# Altium project EPM240_Board.PrjPcb
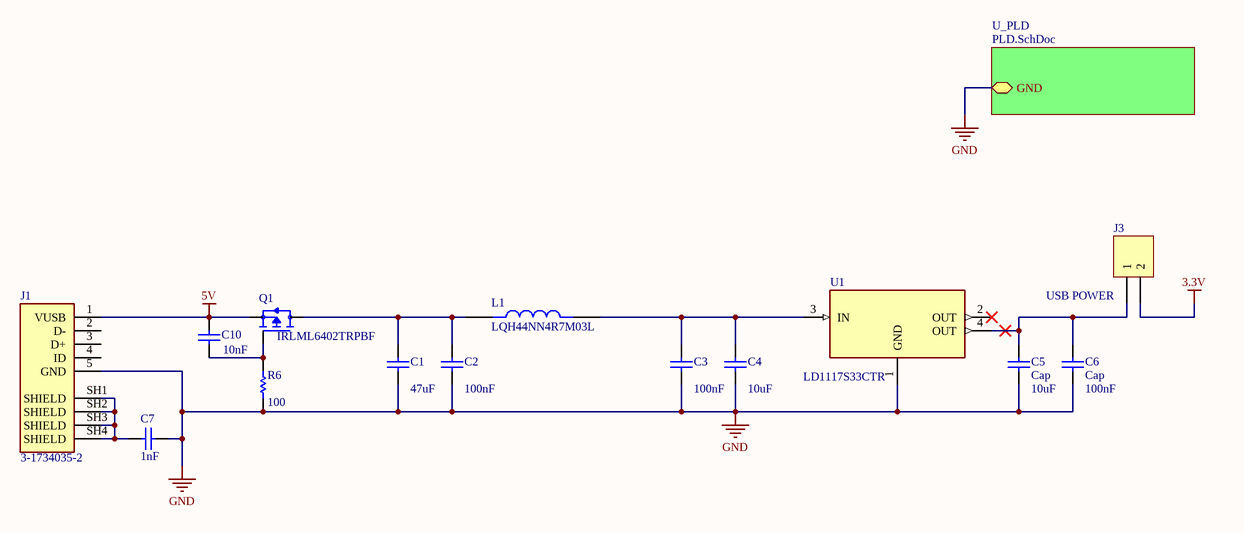
[diagram p0: PWR.SchDoc]
2 sheets, 69 parts. Net scope: hierarchical (ports join the sheet entries above them; power ports are global).
Board file: EPM240_Board.PcbDoc
Sheets:
  PWR.SchDoc
    U_PLD = PLD.SchDoc

## Sheet PWR.SchDoc
size A; SheetNumber: 1; SheetTotal: 2

### Parts
C1  value 47uF  [WCAP-CSGP_885012209019]  (hidden comment: Cap)
C2  value 100nF  [WCAP-CSST_885382207009]  (hidden comment: Cap)
C3  value 100nF  [WCAP-CSST_885382207009]  (hidden comment: Cap)
C4  value 10uF  [WCAP-CSST_885382207009]  (hidden comment: Cap)
C5  Cap  value 10uF  [WCAP-CSST_885382207009]
C6  Cap  value 100nF  [WCAP-CSST_885382207009]
C7  value 1nF  [WCAP-CSST_885382207009]  (hidden comment: Cap)
C10  value 10nF  [WCAP-CSST_885382207009]  (hidden comment: Cap)
J1  3-1734035-2  [TE_3-1734035-2]
J3  USB POWER  [HDR1X2]
L1  LQH44NN4R7M03L  [IND_LQH44NN4R7M03L]
Q1  IRLML6402TRPBF  [SOT95P237X112-3N]
R6  value 100  [WCAP-CSST_885382207009]  (hidden comment: Res1)
U1  LD1117S33CTR  [SOT223]

### Sub-sheets
U_PLD = PLD.SchDoc: GND (bidir)

### Nets
3.3V: J3.2
5V: C10.2 J1.1(VUSB) Q1.2(S)
GND: C1.1 C2.1 C3.1 C4.1 C5.1 C6.1 C7.2 J1.5(GND) R6.1 U1.1(GND) ; sheet U_PLD/GND
NetC1_2: C1.2 C2.2 L1.1 Q1.3(D)
NetC3_2: C3.2 C4.2 L1.2 U1.3(IN)
NetC5_2: C5.2 C6.2 J3.1 U1.4(OUT)
NetC7_1: C7.1 J1.SH1(SHIELD) J1.SH2(SHIELD) J1.SH3(SHIELD) J1.SH4(SHIELD)
NetC10_1: C10.1 Q1.1(G) R6.2

Not connected (* = marked no-connect by the designer): J1 2(D-) 3(D+) 4(ID); U1 2(OUT)*

### Library data of the parts
C1-C7 C10 = Cap: Capacitor; Published: 8-Jun-2000; LatestRevisionDate: 17-Jul-2002; LatestRevisionNote: Re-released for DXP Platform.; PackageReference: RAD-0.3; Publisher: Altium Limited; PackageDescription: Radial Cap, Thru-Hole; 2 Leads; 0.3 in Pin Spacing
J1 = 3-1734035-2: USB Connectors MINI USB, R/A, SMT, MATTE TIN, W/O MYLAR; MF: TE Connectivity; Value: *; SnapEDA_Link: https://www.snapeda.com/parts/3-1734035-2/TE+Connectivity+AMP+Connectors/view-part/?ref=snap; Purchase-URL: https://pricing.snapeda.com/search/part/3-1734035-2/?ref=eda; Availability: In Stock; Price: None; Package: None; Check_prices: https://www.snapeda.com/parts/3-1734035-2/TE+Connectivity+AMP+Connectors/view-part/?ref=eda; MP: 3-1734035-2
J3 = Header 2: Header, 2-Pin; LatestRevisionDate: 17-Jul-2002; LatestRevisionNote: Re-released for DXP Platform.; Publisher: Altium Limited
L1 = LQH44NN4R7M03L: FIXED IND 22UH 950MA 170 MOHM; Package: None; Price: None; Value: *; MP: LQH44NN4R7M03L; Availability: Unavailable
Q1 = IRLML6402TRPBF: RoHS Compliant | Industry-leading quality | Fast Switching | Low Profile _less than 1.1mm_ | P-Channel MOSFET | SOT-23 Footprint; MF: Infineon; Package: SOT-23 Infineon; Value: *; Price: None; MP: IRLML6402TRPBF; SnapEDA_Link: https://www.snapeda.com/parts/IRLML6402TRPBF/Infineon%20Technologies/view-part/523558/?ref=snap; Availability: Unavailable
R6 = Res1: Resistor; Published: 8-Jun-2000; LatestRevisionDate: 17-Jul-2002; LatestRevisionNote: Re-released for DXP Platform.; PackageReference: AXIAL-0.3; Publisher: Altium Limited; PackageDescription: Axial Device, Thru-Hole; 2 Leads; 0.3 in Pin Spacing
U1 = LD1117S33CTR: Linear Voltage Regulator IC Positive Fixed 1 Output 800mA SOT-223; MF: STMicroelectronics; Package: SOT-223 STMicroelectronics; Purchase-URL: https://pricing.snapeda.com/search/part/LD1117S33CTR/?ref=eda; MP: LD1117S33CTR; Value: *; Availability: In Stock; SnapEDA_Link: https://www.snapeda.com/parts/LD1117S33CTR/STMicroelectronics/view-part/?ref=snap; Price: None; Check_prices: https://www.snapeda.com/parts/LD1117S33CTR/STMicroelectronics/view-part/?ref=eda

## Sheet PLD.SchDoc
size 381 x 241 mm; SheetNumber: 2; SheetTotal: 2; SPICEModelCacheQEXEVNCX: <root> / <DocumentId>QEXEVNCX</DocumentId> / <CacheFrame Number="0"> / <Model Name="led0" Kind="MDL"> / <Text>*Typ INFRARED GaAs LED: Vf=1.2V Vr=5V If=40mA trr=3uS / *LED Pinout: 1=A, 2=K / .MODEL LED0 D (IS=93.5P RS=84M N=2.63 BV=5 IBV=10U / + CJO=2.97P VJ=.75 M=.333 TT=4.32U)</Text> / </Model> / </CacheFrame> / </root>
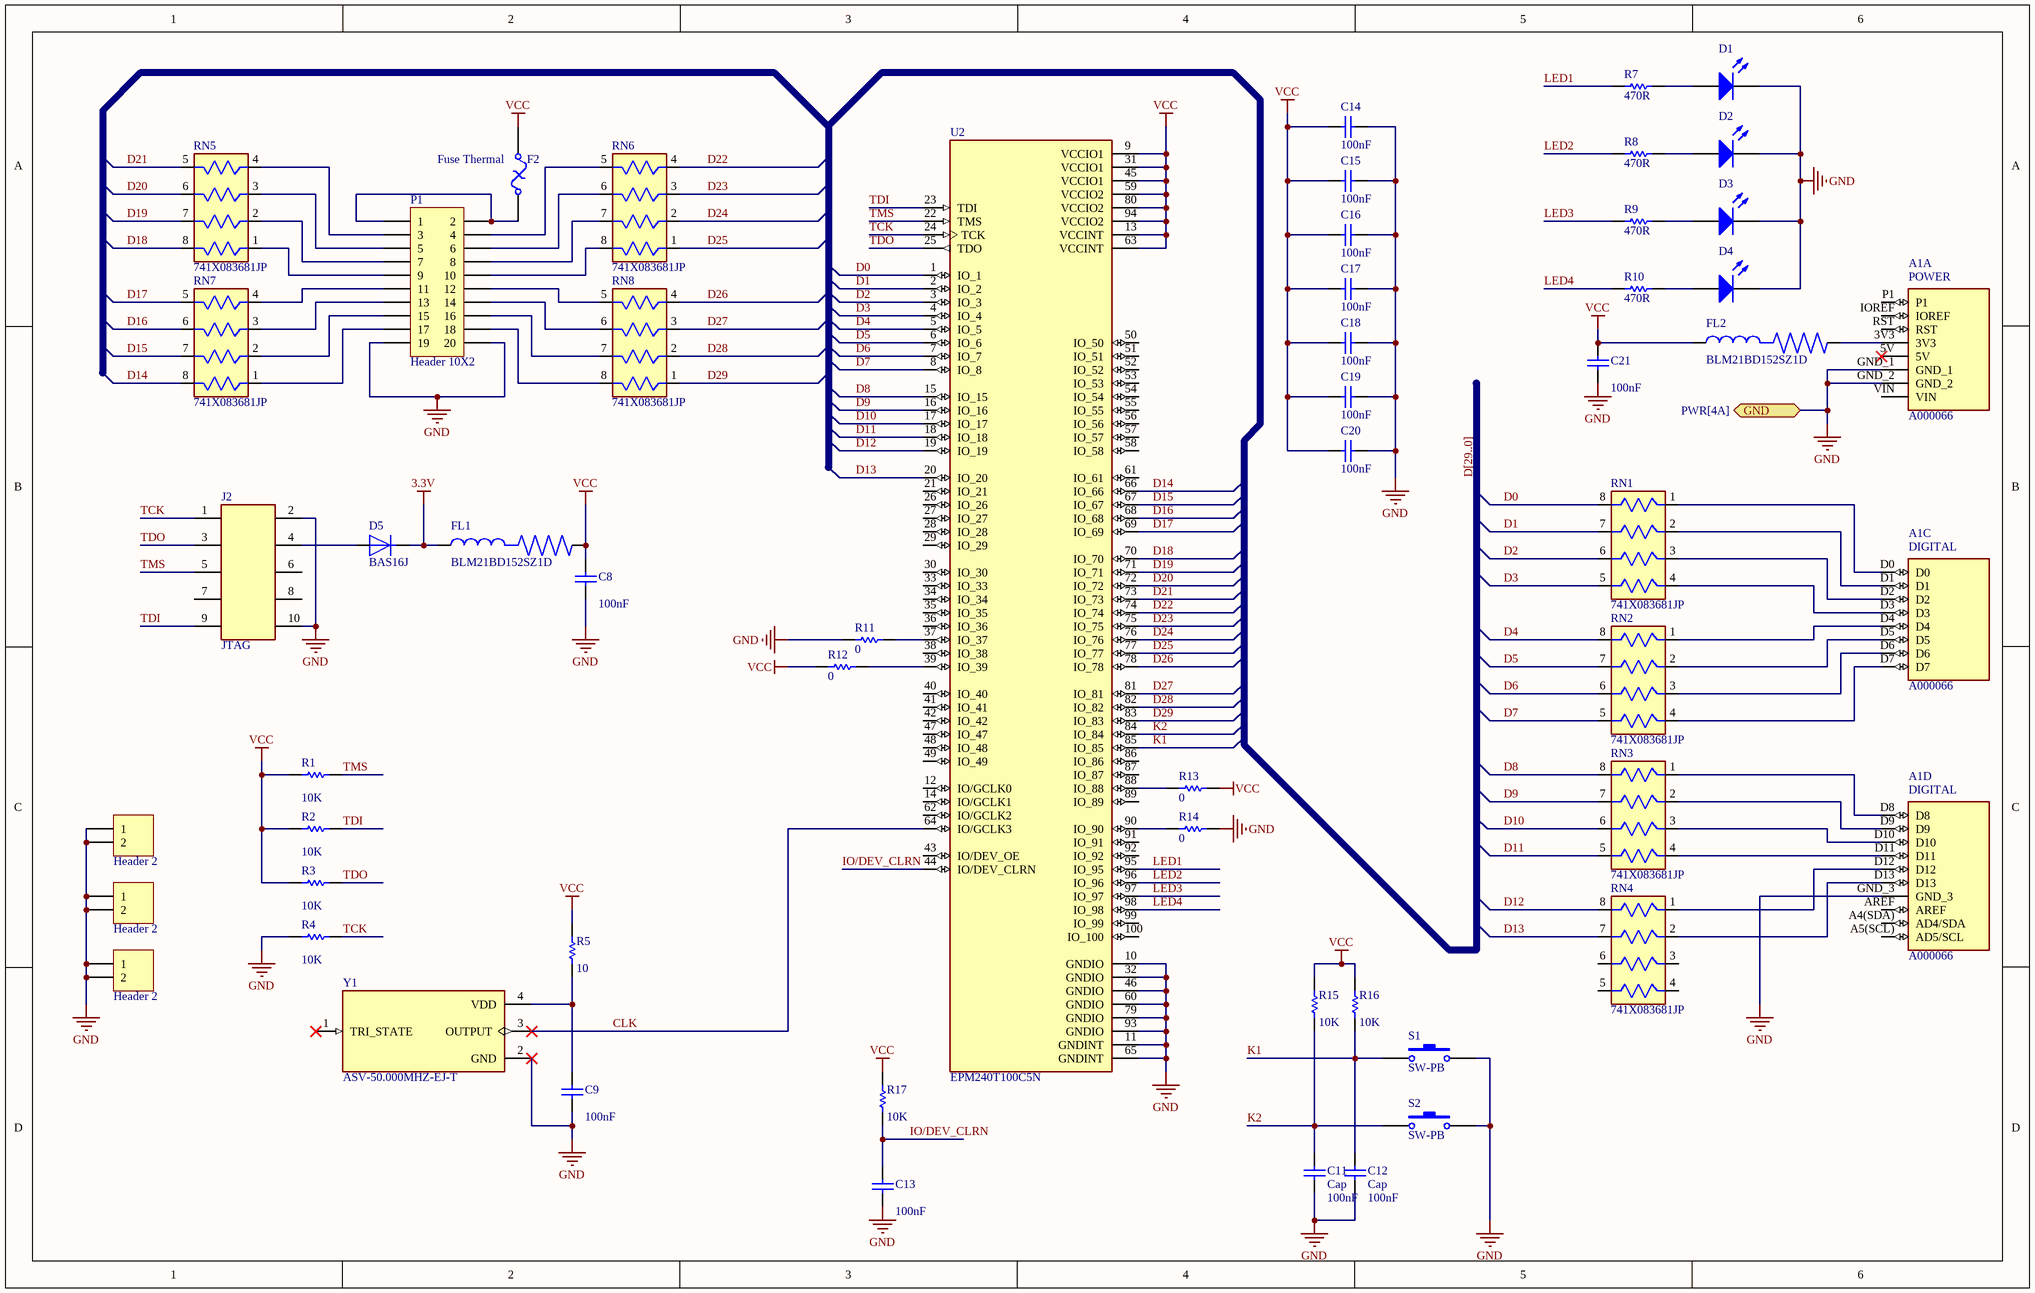
[diagram p1: PLD.SchDoc]

### Parts
A1  A000066  [ARDUINO_A000066]  (parts A,C,D of 4)
C8  value 100nF  [CAPC1608X90]  (hidden comment: Cap)
C9  value 100nF  [CAPC1608X90]  (hidden comment: Cap)
C11  Cap  value 100nF  [WCAP-CSGP_885012105016]
C12  Cap  value 100nF  [WCAP-CSGP_885012105016]
C13  value 100nF  [WCAP-CSGP_885012105016]  (hidden comment: Cap)
C14  value 100nF  [WCAP-CSGP_885012105016]  (hidden comment: Cap)
C15  value 100nF  [WCAP-CSGP_885012105016]  (hidden comment: Cap)
C16  value 100nF  [WCAP-CSGP_885012105016]  (hidden comment: Cap)
C17  value 100nF  [WCAP-CSGP_885012105016]  (hidden comment: Cap)
C18  value 100nF  [WCAP-CSGP_885012105016]  (hidden comment: Cap)
C19  value 100nF  [WCAP-CSGP_885012105016]  (hidden comment: Cap)
C20  value 100nF  [WCAP-CSGP_885012105016]  (hidden comment: Cap)
C21  value 100nF  [CAPC1608X90]  (hidden comment: Cap)
D1  LED0  [CAPC1608X90]  (value not drawn)
D2  LED0  [CAPC1608X90]  (value not drawn)
D3  LED0  [CAPC1608X90]  (value not drawn)
D4  LED0  [CAPC1608X90]  (value not drawn)
D5  BAS16J  [SOD323F]
F2  Fuse Thermal  [C1206]
FL1  BLM21BD152SZ1D  [C1206]
FL2  BLM21BD152SZ1D  [C1206]
H2  Header 2  [HDR1X2]
H3  Header 2  [HDR1X2]
H4  Header 2  [HDR1X2]
J2  JTAG  [61201021621]
P1  Header 10X2  [2002132110020C4LF]
R1  value 10K  [CAPC1608X90]  (hidden comment: Res1)
R2  value 10K  [CAPC1608X90]  (hidden comment: Res1)
R3  value 10K  [CAPC1608X90]  (hidden comment: Res1)
R4  value 10K  [CAPC1608X90]  (hidden comment: Res1)
R5  value 10  [CAPC1608X90]  (hidden comment: Res1)
R7  value 470R  [CAPC1608X90]  (hidden comment: Res1)
R8  value 470R  [CAPC1608X90]  (hidden comment: Res1)
R9  value 470R  [CAPC1608X90]  (hidden comment: Res1)
R10  value 470R  [CAPC1608X90]  (hidden comment: Res1)
R11  value 0  [WCAP-CSGP_885012105016]  (hidden comment: Res1)
R12  value 0  [WCAP-CSGP_885012105016]  (hidden comment: Res1)
R13  value 0  [WCAP-CSGP_885012105016]  (hidden comment: Res1)
R14  value 0  [WCAP-CSGP_885012105016]  (hidden comment: Res1)
R15  value 10K  [WCAP-CSGP_885012105016]  (hidden comment: Res1)
R16  value 10K  [WCAP-CSGP_885012105016]  (hidden comment: Res1)
R17  value 10K  [WCAP-CSGP_885012105016]  (hidden comment: Res1)
RN1  741X083681JP  [RESCAXS50P200X100X45_8N]
RN2  741X083681JP  [RESCAXS50P200X100X45_8N]
RN3  741X083681JP  [RESCAXS50P200X100X45_8N]
RN4  741X083681JP  [RESCAXS50P200X100X45_8N]
RN5  741X083681JP  [RESCAXS50P200X100X45_8N]
RN6  741X083681JP  [RESCAXS50P200X100X45_8N]
RN7  741X083681JP  [RESCAXS50P200X100X45_8N]
RN8  741X083681JP  [RESCAXS50P200X100X45_8N]
S1  SW-PB  [SW_4.5X4.5]
S2  SW-PB  [SW_4.5X4.5]
U2  EPM240T100C5N  [QFP50P1600X1600X120-100N]
Y1  ASV-50.000MHZ-EJ-T  [XTAL_ASV-50.000MHZ-EJ-T]

### Ports
GND (bidir, see PWR[4A])

### Nets
3.3V: D5.1(K) FL1.1
GND: A1.GND_1 A1.GND_2 A1.GND_3 C8.1 C9.1 C11.1 C12.1 C13.1 C14.1 C15.1 C16.1 C17.1 C18.1 C19.1 C20.1 C21.1 D1.2(K) D2.2(K) D3.2(K) D4.2(K) H2.1 H2.2 H3.1 H3.2 H4.1 H4.2 J2.2 J2.10 P1.19 P1.20 R4.1 R11.2 R14.1 S1.2 S2.2 U2.10(GNDIO) U2.11(GNDINT) U2.32(GNDIO) U2.46(GNDIO) U2.60(GNDIO) U2.65(GNDINT) U2.79(GNDIO) U2.93(GNDIO) Y1.2(GND) ; port GND
VCC: C8.2 C14.2 C15.2 C16.2 C17.2 C18.2 C19.2 C20.2 C21.2 F2.2 FL1.2 FL2.1 R1.1 R2.1 R3.1 R5.2 R12.2 R13.1 R15.2 R16.2 R17.2 U2.9(VCCIO1) U2.13(VCCINT) U2.31(VCCIO1) U2.45(VCCIO1) U2.59(VCCIO2) U2.63(VCCINT) U2.80(VCCIO2) U2.94(VCCIO2)
CLK: U2.64(IO/GCLK3) Y1.3(OUTPUT)
D0: RN1.8 U2.1(IO_1)
D1: RN1.7 U2.2(IO_2)
D2: RN1.6 U2.3(IO_3)
D3: RN1.5 U2.4(IO_4)
D4: RN2.8 U2.5(IO_5)
D5: RN2.7 U2.6(IO_6)
D6: RN2.6 U2.7(IO_7)
D7: RN2.5 U2.8(IO_8)
D8: RN3.8 U2.15(IO_15)
D9: RN3.7 U2.16(IO_16)
D10: RN3.6 U2.17(IO_17)
D11: RN3.5 U2.18(IO_18)
D12: RN4.8 U2.19(IO_19)
D13: RN4.7 U2.20(IO_20)
D14: RN7.8 U2.66(IO_66)
D15: RN7.7 U2.67(IO_67)
D16: RN7.6 U2.68(IO_68)
D17: RN7.5 U2.69(IO_69)
D18: RN5.8 U2.70(IO_70)
D19: RN5.7 U2.71(IO_71)
D20: RN5.6 U2.72(IO_72)
D21: RN5.5 U2.73(IO_73)
D22: RN6.4 U2.74(IO_74)
D23: RN6.3 U2.75(IO_75)
D24: RN6.2 U2.76(IO_76)
D25: RN6.1 U2.77(IO_77)
D26: RN8.4 U2.78(IO_78)
D27: RN8.3 U2.81(IO_81)
D28: RN8.2 U2.82(IO_82)
D29: RN8.1 U2.83(IO_83)
IO/DEV_CLRN: C13.2 R17.1 U2.44(IO/DEV_CLRN)
K1: C12.2 R16.1 S1.1 U2.85(IO_85)
K2: C11.2 R15.1 S2.1 U2.84(IO_84)
LED1: R7.2 U2.95(IO_95)
LED2: R8.2 U2.96(IO_96)
LED3: R9.2 U2.97(IO_97)
LED4: R10.2 U2.98(IO_98)
TCK: J2.1 R4.2 U2.24(TCK)
TDI: J2.9 R2.2 U2.23(TDI)
TDO: J2.3 R3.2 U2.25(TDO)
TMS: J2.5 R1.2 U2.22(TMS)
NetA1_3V3: A1.3V3 FL2.2
NetA1_D0: A1.D0 RN1.1
NetA1_D1: A1.D1 RN1.2
NetA1_D2: A1.D2 RN1.3
NetA1_D3: A1.D3 RN1.4
NetA1_D4: A1.D4 RN2.1
NetA1_D5: A1.D5 RN2.2
NetA1_D6: A1.D6 RN2.3
NetA1_D7: A1.D7 RN2.4
NetA1_D8: A1.D8 RN3.1
NetA1_D9: A1.D9 RN3.2
NetA1_D10: A1.D10 RN3.3
NetA1_D11: A1.D11 RN3.4
NetA1_D12: A1.D12 RN4.1
NetA1_D13: A1.D13 RN4.2
NetC9_2: C9.2 R5.1 Y1.4(VDD)
NetD1_1: D1.1(A) R7.1
NetD2_1: D2.1(A) R8.1
NetD3_1: D3.1(A) R9.1
NetD4_1: D4.1(A) R10.1
NetD5_2: D5.2(A) J2.4
NetF2_1: F2.1 P1.1 P1.2
NetP1_3: P1.3 RN5.4
NetP1_4: P1.4 RN6.5
NetP1_5: P1.5 RN5.3
NetP1_6: P1.6 RN6.6
NetP1_7: P1.7 RN5.2
NetP1_8: P1.8 RN6.7
NetP1_9: P1.9 RN5.1
NetP1_10: P1.10 RN6.8
NetP1_11: P1.11 RN7.4
NetP1_12: P1.12 RN8.5
NetP1_13: P1.13 RN7.3
NetP1_14: P1.14 RN8.6
NetP1_15: P1.15 RN7.2
NetP1_16: P1.16 RN8.7
NetP1_17: P1.17 RN7.1
NetP1_18: P1.18 RN8.8
NetR11_1: R11.1 U2.37(IO_37)
NetR12_1: R12.1 U2.39(IO_39)
NetR13_2: R13.2 U2.88(IO_88)
NetR14_2: R14.2 U2.90(IO_90)

Not connected (* = marked no-connect by the designer): A1 5V* A4(SDA)(AD4/SDA) A5(SCL)(AD5/SCL) AREF IOREF P1 RST VIN; J2 6 7 8; RN4 3 4 5 6; U2 12(IO/GCLK0) 14(IO/GCLK1) 21(IO_21) 26(IO_26) 27(IO_27) 28(IO_28) 29(IO_29) 30(IO_30) 33(IO_33) 34(IO_34) 35(IO_35) 36(IO_36) 38(IO_38) 40(IO_40) 41(IO_41) 42(IO_42) 43(IO/DEV_OE) 47(IO_47) 48(IO_48) 49(IO_49) 50(IO_50) 51(IO_51) 52(IO_52) 53(IO_53) 54(IO_54) 55(IO_55) 56(IO_56) 57(IO_57) 58(IO_58) 61(IO_61) 62(IO/GCLK2) 86(IO_86) 87(IO_87) 89(IO_89) 91(IO_91) 92(IO_92) 99(IO_99) 100(IO_100); Y1 1(TRI_STATE)*

### Buses and harness runs
bus D[29..0]

### Notes on the sheet
- (in symbol A000066, part A) POWER
- (in symbol A000066, part C) DIGITAL
- (in symbol A000066, part D) DIGITAL

### Library data of the parts
A1 = A000066: Microcontroller board based on the ATmega328P; pin to pad: A4(SDA)>A4(SDA; MP: ARDUINO UNO REV3 DEVELOPMENT BOARD; MF: Arduino; Price: None; Availability: Not in stock; Package: None; Value: *; SnapEDA_Link: https://www.snapeda.com/parts/ARDUINO%20UNO%20REV3%20DEVELOPMENT%20BOARD/Arduino/view-part/?ref=snap; Check_prices: https://www.snapeda.com/parts/ARDUINO%20UNO%20REV3%20DEVELOPMENT%20BOARD/Arduino/view-part/?ref=eda
C8 C9 C11-C21 = Cap: Capacitor; Published: 8-Jun-2000; LatestRevisionDate: 17-Jul-2002; LatestRevisionNote: Re-released for DXP Platform.; PackageReference: RAD-0.3; Publisher: Altium Limited; PackageDescription: Radial Cap, Thru-Hole; 2 Leads; 0.3 in Pin Spacing
D1-D4 = LED0: Typical INFRARED GaAs LED; Published: 8-Jun-2000; LatestRevisionDate: 08-Jul-2005; LatestRevisionNote: Mech Layer 1 removed.; PackageReference: LED-0; Publisher: Altium Limited; PackageDescription: LED; 2 Leads
D5 = BAS16J: Diode Standard 100V 250mA _DC_ Surface Mount SOD-323F; MF: Nexperia USA; Package: SOD-323 Nexperia USA; Value: *; Availability: Unavailable; SnapEDA_Link: https://www.snapeda.com/parts/BAS16J/Nexperia%20USA%20Inc./view-part/216819/?ref=snap; Price: None; MP: BAS16J
F2 = Fuse Thermal: Thermal Fuse; Published: 24-Mar-1999; LatestRevisionDate: 17-Jul-2002; LatestRevisionNote: Re-released for DXP Platform.; PackageReference: PIN-W2/E2.8; Publisher: Altium Limited; PackageDescription: Thru-Hole; 2 Leads
FL1 FL2 = BLM21BD152SZ1D: 1 Ferrite Bead 0805 (2012 Metric) 250mA 450mOhm; MF: Murata; Mouser-Purchase-URL: https://snapeda.com/shop?store=Mouser&id=2726779; Value: *; Package: 2012 Murata; Price: None; MP: BLM21BD152SZ1D; SnapEDA_Link: https://www.snapeda.com/parts/BLM21BD152SZ1D/Murata/view-part/2726779/?ref=snap; Availability: Warning; Check_prices: https://www.snapeda.com/parts/BLM21BD152SZ1D/Murata/view-part/2726779/?ref=eda
H2-H4 = Header 2: Header, 2-Pin; LatestRevisionDate: 17-Jul-2002; LatestRevisionNote: Re-released for DXP Platform.; Publisher: Altium Limited
J2 = 61201021621: Connector Header Through Hole 10 position 0.100 _2.54mm_; MF: Wurth Electronics; Price: None; Package: None; Value: *; MP: 61201021621; Availability: Unavailable; SnapEDA_Link: https://www.snapeda.com/parts/61201021621/Wurth%20Electronics%20Inc./view-part/1156232/?ref=snap
P1 = Header 10X2: Header, 10-Pin, Dual row; LatestRevisionDate: 17-Jul-2002; LatestRevisionNote: Re-released for DXP Platform.; Publisher: Altium Limited
R1-R5 R7-R17 = Res1: Resistor; Published: 8-Jun-2000; LatestRevisionDate: 17-Jul-2002; LatestRevisionNote: Re-released for DXP Platform.; PackageReference: AXIAL-0.3; Publisher: Altium Limited; PackageDescription: Axial Device, Thru-Hole; 2 Leads; 0.3 in Pin Spacing
RN1-RN8 = 741X083681JP: Resistor Networks & Arrays 680ohms 5% Isolated; MF: CTS Components; Value: *; Package: 0402 CTS Components; SnapEDA_Link: https://www.snapeda.com/parts/741X083681JP/CTS%20Components/view-part/1384528/?ref=snap; Price: None; Check_prices: https://www.snapeda.com/parts/741X083681JP/CTS%20Components/view-part/1384528/?ref=eda; Availability: In Stock; MP: 741X083681JP
S1 S2 = SW-PB: Switch; Published: 24-Mar-1999; LatestRevisionDate: 17-Jul-2002; LatestRevisionNote: Re-released for DXP Platform.; PackageReference: SPST-2; Publisher: Altium Limited; PackageDescription: Switch; 2 Leads
U2 = EPM240T100C5N: IC CPLD 192MC 4.7NS 100TQFP; MF: Intel; Availability: Unavailable; Value: *; Package: TQFP-100 Altera; SnapEDA_Link: https://www.snapeda.com/parts/EPM240T100C5N/Intel/view-part/38204/?ref=snap; Price: None; MP: EPM240T100C5N
Y1 = ASV-50.000MHZ-EJ-T: Package: None; Value: *; Availability: Unavailable; Price: None; MP: ASV-50.000MHZ-EJ-T

## Nets that join several sheets
3.3V: PWR (J3.2), PLD (D5.1 FL1.1)
GND: PWR (10 pins), PLD (44 pins)